# EAGLE schematic DipSeq_board_12HP_20150414 (EAGLE 7.1.0)

## Sheet 1 of 3: muxes
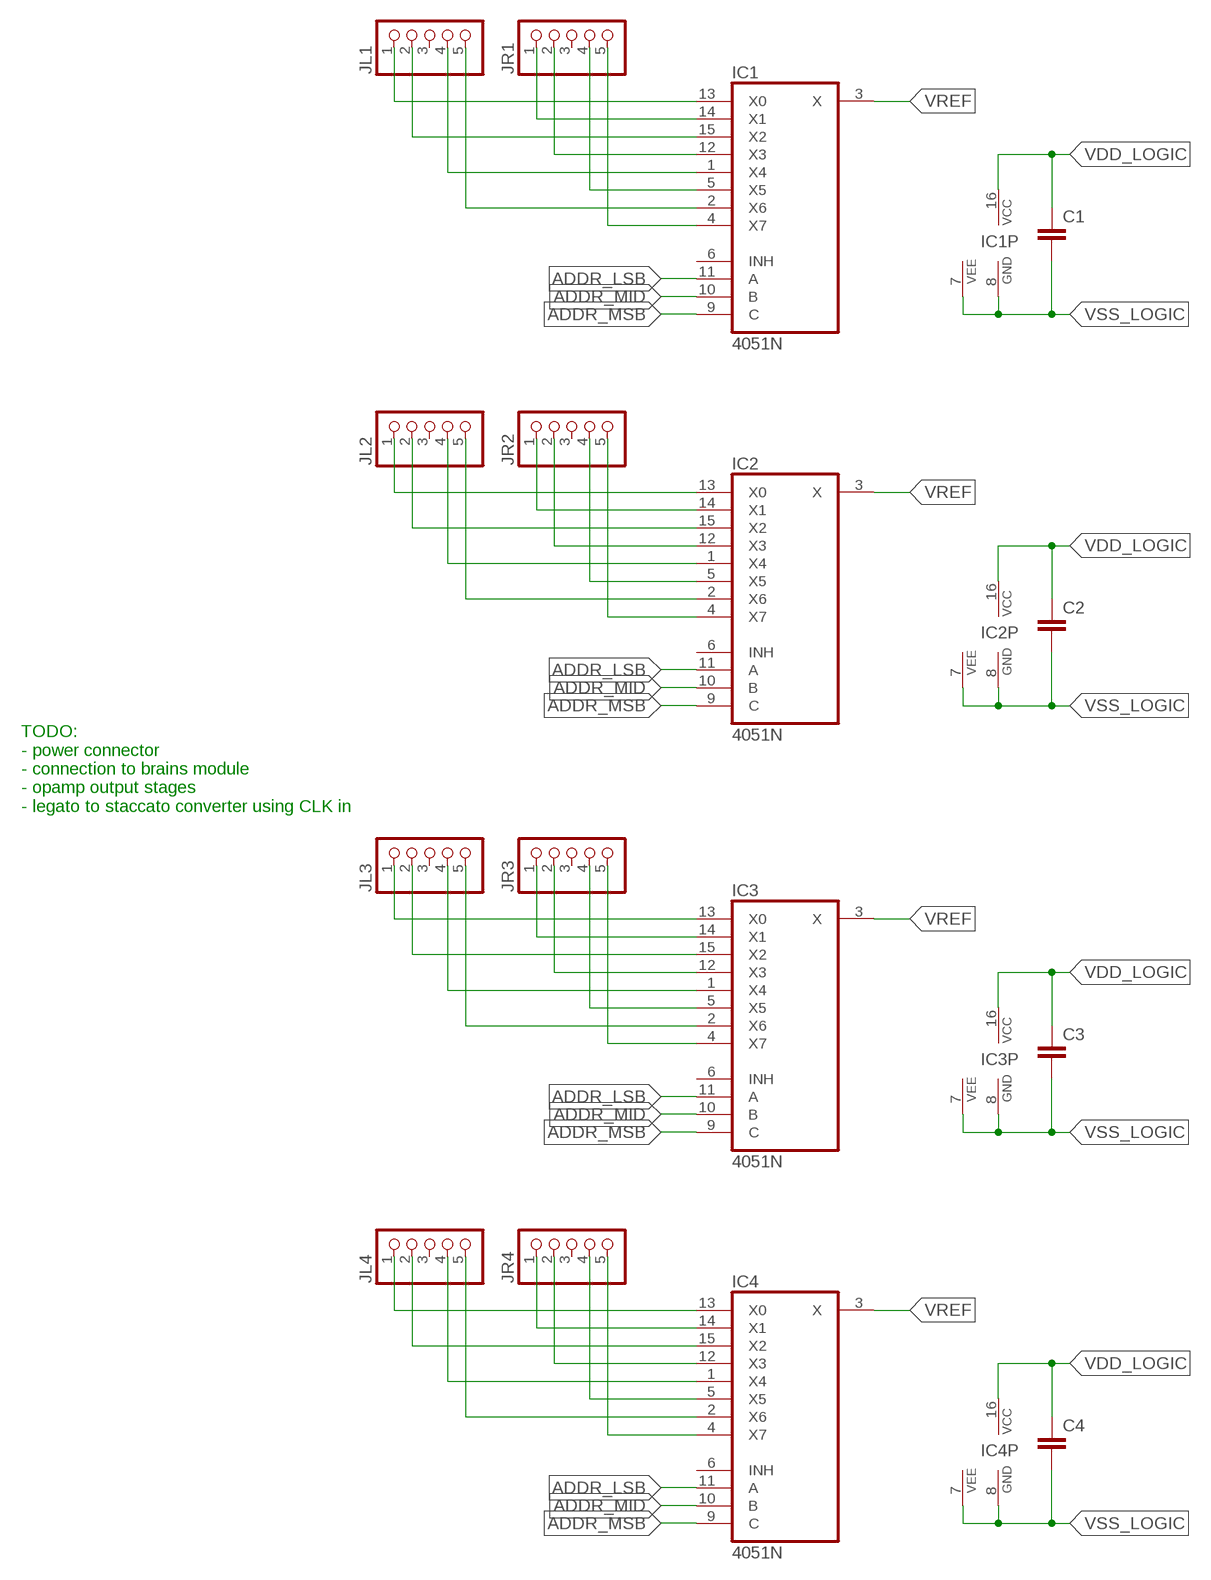
[diagram p0: schematic, sheet 1]

### Parts
C1  C-EU  [CAP_0805]
C2  C-EU  [CAP_0805]
C3  C-EU  [CAP_0805]
C4  C-EU  [CAP_0805]
IC1  4051N  [DIL16]
IC2  4051N  [DIL16]
IC3  4051N  [DIL16]
IC4  4051N  [DIL16]
JL1  PINHD-1X5  [1X05]
JL2  PINHD-1X5  [1X05]
JL3  PINHD-1X5  [1X05]
JL4  PINHD-1X5  [1X05]
JR1  PINHD-1X5  [1X05]
JR2  PINHD-1X5  [1X05]
JR3  PINHD-1X5  [1X05]
JR4  PINHD-1X5  [1X05]

### Nets
ADDR_LSB: IC1.11(A) IC2.11(A) IC3.11(A) IC4.11(A)
ADDR_MID: IC1.10(B) IC2.10(B) IC3.10(B) IC4.10(B)
ADDR_MSB: IC1.9(C) IC2.9(C) IC3.9(C) IC4.9(C)
S1: IC1.13(X0) JL1.1
S2: IC1.14(X1) JR1.1
S3: IC1.15(X2) JL1.2
S4: IC1.12(X3) JR1.2
S5: IC1.1(X4) JL1.4
S6: IC1.5(X5) JR1.4
S7: IC1.2(X6) JL1.5
S8: IC1.4(X7) JR1.5
S9: IC2.13(X0) JL2.1
S10: IC2.15(X2) JL2.2
S11: IC2.1(X4) JL2.4
S12: IC2.2(X6) JL2.5
S13: IC2.14(X1) JR2.1
S14: IC2.12(X3) JR2.2
S15: IC2.5(X5) JR2.4
S16: IC2.4(X7) JR2.5
S17: IC3.13(X0) JL3.1
S18: IC3.15(X2) JL3.2
S19: IC3.1(X4) JL3.4
S20: IC3.2(X6) JL3.5
S21: IC3.14(X1) JR3.1
S22: IC3.12(X3) JR3.2
S23: IC3.5(X5) JR3.4
S24: IC3.4(X7) JR3.5
S25: IC4.13(X0) JL4.1
S26: IC4.15(X2) JL4.2
S27: IC4.1(X4) JL4.4
S28: IC4.2(X6) JL4.5
S29: IC4.14(X1) JR4.1
S30: IC4.12(X3) JR4.2
S31: IC4.5(X5) JR4.4
S32: IC4.4(X7) JR4.5
VDD_LOGIC: C1.1 C2.1 C3.1 C4.1 IC1.16(VCC) IC2.16(VCC) IC3.16(VCC) IC4.16(VCC)
VREF: IC1.3(X) IC2.3(X) IC3.3(X) IC4.3(X)
VSS_LOGIC: C1.2 C2.2 C3.2 C4.2 IC1.7(VEE) IC1.8(GND) IC2.7(VEE) IC2.8(GND) IC3.7(VEE) IC3.8(GND) IC4.7(VEE) IC4.8(GND)
Unconnected: IC1.6(INH) IC2.6(INH) IC3.6(INH) IC4.6(INH) JL1.3 JL2.3 JL3.3 JL4.3 JR1.3 JR2.3 JR3.3 JR4.3

### Notes on the sheet
- TODO:
  - power connector
  - connection to brains module
  - opamp output stages
  - legato to staccato converter using CLK in

## Sheet 2 of 3: outputs
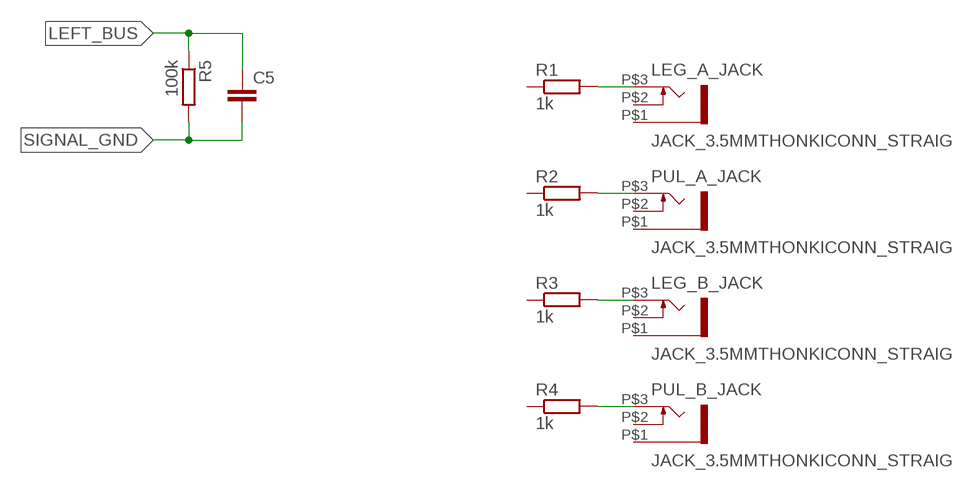
[diagram p1: schematic, sheet 2]

### Parts
C5  C-EU  [CAP_0805]
LEG_A_JACK  JACK_3.5MMTHONKICONN_STRAIGHT  [THONKICONN_LAYOUT]
LEG_B_JACK  JACK_3.5MMTHONKICONN_STRAIGHT  [THONKICONN_LAYOUT]
PUL_A_JACK  JACK_3.5MMTHONKICONN_STRAIGHT  [THONKICONN_LAYOUT]
PUL_B_JACK  JACK_3.5MMTHONKICONN_STRAIGHT  [THONKICONN_LAYOUT]
R1  1k  R-EU_R0805W  [R_0805_MINE]
R2  1k  R-EU_R0805W  [R_0805_MINE]
R3  1k  R-EU_R0805W  [R_0805_MINE]
R4  1k  R-EU_R0805W  [R_0805_MINE]
R5  100k  R-EU_R0805W  [R_0805_MINE]

### Nets
LEFT_BUS: C5.1 R5.1
N$1: LEG_A_JACK.P$3(TIP) R1.2
N$2: PUL_A_JACK.P$3(TIP) R2.2
N$3: LEG_B_JACK.P$3(TIP) R3.2
N$4: PUL_B_JACK.P$3(TIP) R4.2
SIGNAL_GND: C5.2 R5.2
Unconnected: LEG_A_JACK.P$1(SLEEVE) LEG_A_JACK.P$2(SWITCH) LEG_B_JACK.P$1(SLEEVE) LEG_B_JACK.P$2(SWITCH) PUL_A_JACK.P$1(SLEEVE) PUL_A_JACK.P$2(SWITCH) PUL_B_JACK.P$1(SLEEVE) PUL_B_JACK.P$2(SWITCH) R1.1 R2.1 R3.1 R4.1

## Sheet 3 of 3: other
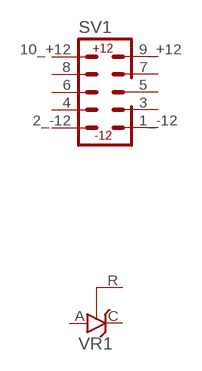
[diagram p2: schematic, sheet 3]

### Parts
SV1  BOXHEADER_10P  [MY_BOXHEADER_2X5]
VR1  TL431CLP  [TO92-CLP]
Unconnected: SV1.1_-12 SV1.2_-12 SV1.3(3_GND) SV1.4(4_GND) SV1.5(5_GND) SV1.6(6_GND) SV1.7(7_GND) SV1.8(8_GND) SV1.9_+12 SV1.10_+12 VR1.A VR1.C VR1.R

## Library data of the parts
C1-C5 = amdagan:C-EU: CAPACITOR, European symbol
IC1-IC4 = 40xx:4051: 8-channel ANALOG MULTIPLEXER
JL1-JL4 JR1-JR4 = amdagan:PINHD-1X5: PIN HEADER
LEG_A_JACK LEG_B_JACK PUL_A_JACK PUL_B_JACK = amdagan:JACK_3.5MM
R1-R5 = amdagan:R-EU_: RESISTOR, European symbol
SV1 = amdagan:BOXHEADER_10P: HARTING
VR1 = v-reg:TL431CLP: VOLTAGE REGULATOR